# Altium schematic sheet integrator.SchDoc
size A4
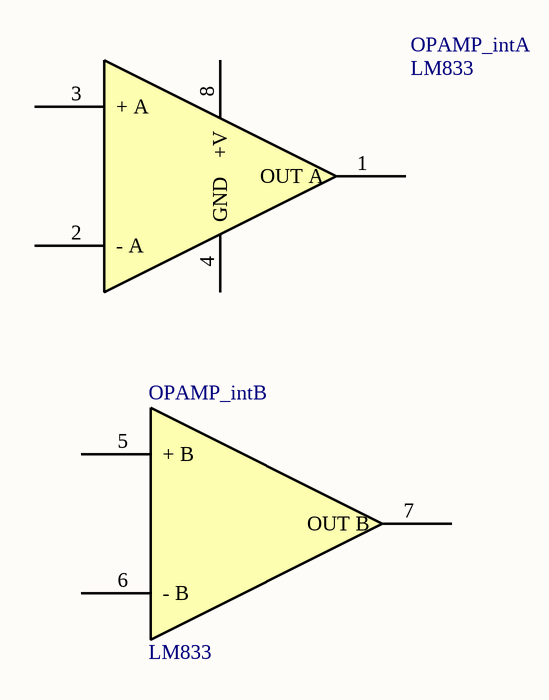
[diagram p0: integrator.SchDoc]

## Parts
OPAMP_int  LM833  [DIP8]  (parts A,B of 2)

## Nets

Not connected (* = marked no-connect by the designer): OPAMP_int 1(OUT_A) 2(-_A) 3(+_A) 4(GND) 5(+_B) 6(-_B) 7(OUT_B) 8(+V)

## Library data of the parts
OPAMP_int = LM833: Dual Audio Operational Amplifier